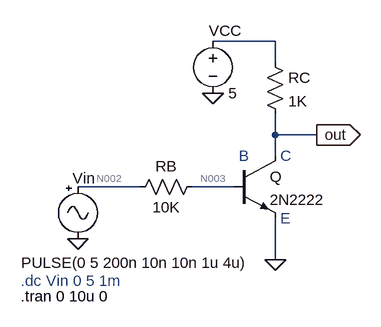
[diagram p0: schematic inverter_rtl.asc]
inverter_rtl.asc, the LTspice schematic file:
Version 4.1
SHEET 1 880 680
WIRE 272 -64 176 -64
WIRE 272 -32 272 -64
WIRE 272 80 272 48
WIRE 336 80 272 80
WIRE 272 112 272 80
WIRE 64 160 -32 160
WIRE 208 160 144 160
WIRE 272 272 272 208
FLAG 272 272 0
FLAG 336 80 out
IOPIN 336 80 Out
FLAG 176 16 0
FLAG -32 240 0
SYMBOL res 160 144 R90
WINDOW 0 0 56 VBottom 2
WINDOW 3 32 56 VTop 2
SYMATTR InstName RB
SYMATTR Value 10K
SYMBOL npn 208 112 R0
SYMATTR InstName Q
SYMATTR Value 2N2222
SYMBOL res 256 -48 R0
SYMATTR InstName RC
SYMATTR Value 1K
SYMBOL voltage 176 -80 R0
WINDOW 0 -6 0 Left 2
SYMATTR InstName VCC
SYMATTR Value 5
SYMBOL Misc\\signal -32 144 R0
WINDOW 0 -8 3 Left 2
WINDOW 3 -87 133 Left 2
WINDOW 123 0 0 Left 0
WINDOW 39 0 0 Left 0
SYMATTR InstName Vin
SYMATTR Value PULSE(0 5 200n 10n 10n 1u 4u)
TEXT 280 112 Left 2 ;C
TEXT 280 208 Left 2 ;E
TEXT 216 112 Left 2 ;B
TEXT -120 304 Left 2 ;.dc Vin 0 5 1m
TEXT -120 328 Left 2 !.tran 0 10u 0

The netlist it stands for:
* inverter_rtl.asc
RB N003 N002 10K
Q out N003 0 0 2N2222
RC N001 out 1K
VCC N001 0 5
Vin N002 0 PULSE(0 5 200n 10n 10n 1u 4u)
.model NPN NPN
.model PNP PNP
.lib standard.bjt
* C
* E
* B
* .dc Vin 0 5 1m
.tran 0 10u 0
.backanno
.end

* Results of the author's LTspice run, read from the files saved beside the schematic
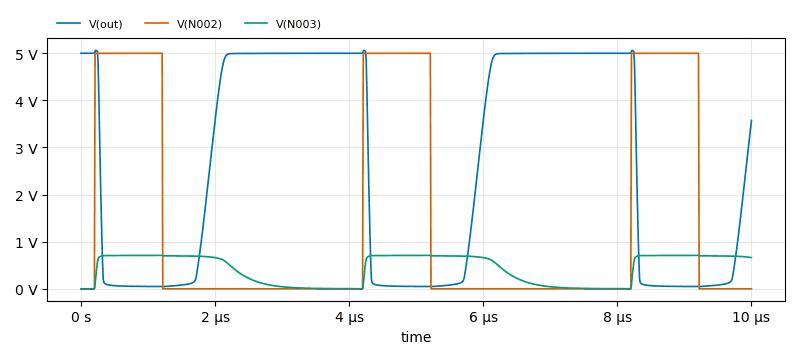
[diagram p1: Transient Analysis of inverter_rtl.asc, plotted from the saved traces]
* Transient Analysis, 1 run:
*   V(out): min 46.81 mV, max 5.062 V, average 2.598 V, rms 3.502 V, last 3.575 V
*   V(N002): min 0 V, max 5 V, average 1.515 V, rms 2.75 V, last 0 V
*   V(N003): min 0 V, max 709.4 mV, average 431.7 mV, rms 533 mV, last 662.2 mV